# EAGLE design microcontroller (EAGLE 9.5.0)
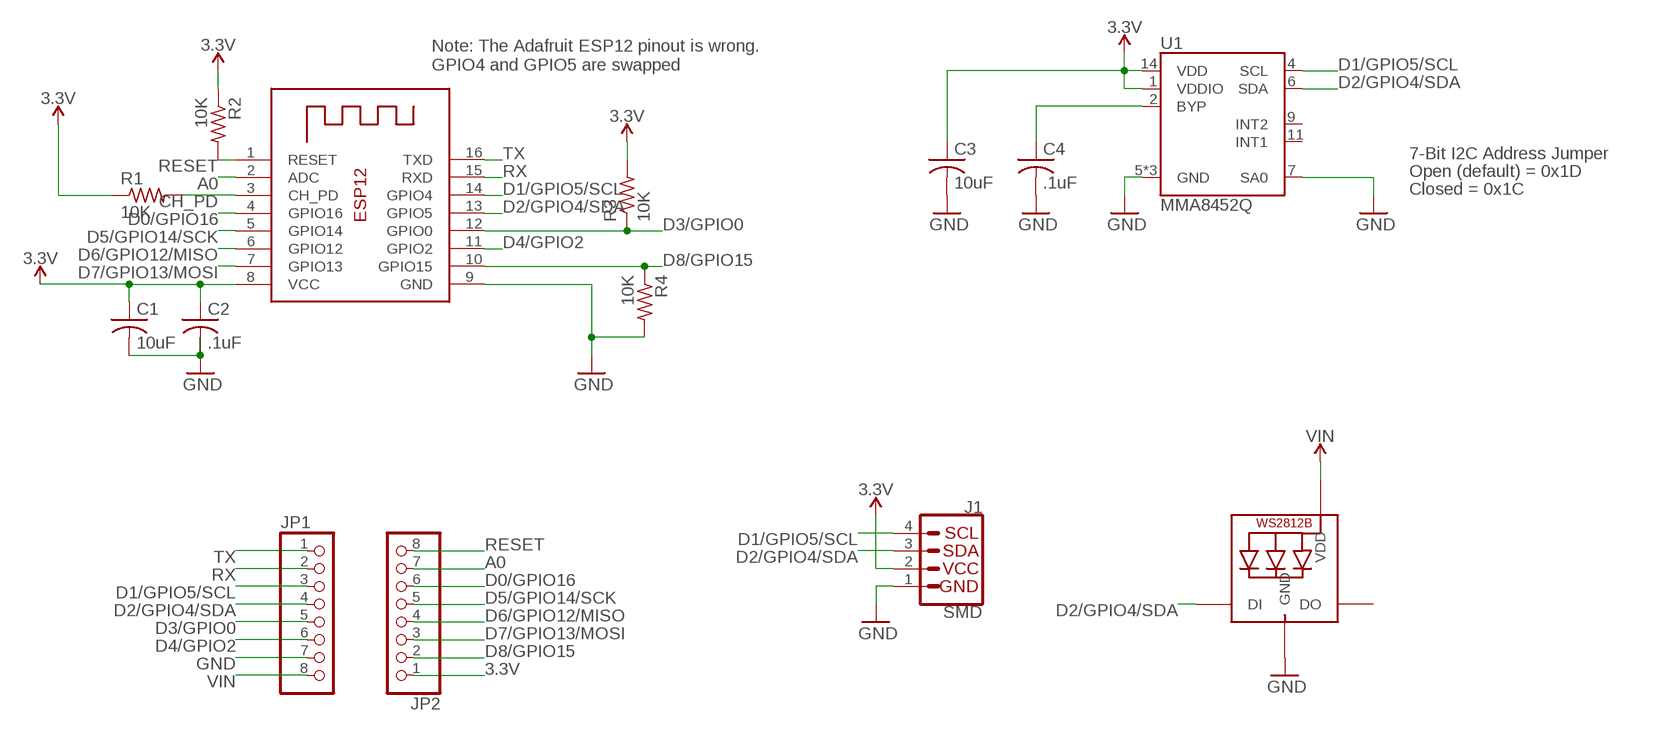
[diagram p0: schematic, sheet 1]

## Parts
C1  10uF  C-USC0805  [C0805]
C2  .1uF  C-USC0805  [C0805]
C3  10uF  C-USC0805  [C0805]
C4  .1uF  C-USC0805  [C0805]
J1  SMD  I2C_STANDARDJS-1MM  [1X04_1MM_RA]
JP1  PINHD-1X8CLEANBIG  [1X08-CLEANBIG]
JP2  PINHD-1X8CLEANBIG  [1X08-CLEANBIG]
LED1  WS2812B5050  [WS2812B]
R1  10K  R-US_R0805  [R0805]
R2  10K  R-US_R0805  [R0805]
R3  10K  R-US_R0805  [R0805]
R4  10K  R-US_R0805  [R0805]
U1  MMA8452Q  [QFN-16_0.5MM]
X1  ESP-12  [ESP-12]

## Nets
3.3V [power]: C1.1 C2.1 C3.1 J1.2(VCC) JP2.1 R1.1 R2.1 R3.2 U1.1(VDDIO) U1.14(VDD) X1.8(VCC)
A0: JP2.7 X1.2(ADC)
BYP: C4.1 U1.2(BYP)
CH_PD: R1.2 X1.3(CH_PD)
D0/GPIO16: JP2.6 X1.4(GPIO16)
D1/GPIO5/SCL: J1.4(SCL) JP1.3 U1.4(SCL) X1.14(GPIO4)
D2/GPIO4/SDA: J1.3(SDA) JP1.4 LED1.4-DIN(DI) U1.6(SDA) X1.13(GPIO5)
D3/GPIO0: JP1.5 R3.1 X1.12(GPIO0)
D4/GPIO2: JP1.6 X1.11(GPIO2)
D5/GPIO14/SCK: JP2.5 X1.5(GPIO14)
D6/GPIO12/MISO: JP2.4 X1.6(GPIO12)
D7/GPIO13/MOSI: JP2.3 X1.7(GPIO13)
D8/GPIO15: JP2.2 R4.1 X1.10(GPIO15)
GND: C1.2 C2.2 C3.2 C4.2 J1.1(GND) JP1.7 LED1.3-GND(GND) R4.2 U1.5(GND) U1.7(SA0) U1.10(GND) U1.12(GND) X1.9(GND)
RESET: JP2.8 R2.2 X1.1(RESET)
RX: JP1.2 X1.15(RXD)
TX: JP1.1 X1.16(TXD)
VIN [power]: JP1.8 LED1.1-VDD(VDD)
Unconnected: LED1.2-DOUT(DO) U1.9(INT2) U1.11(INT1)

## Notes on the sheet
- Note: The Adafruit ESP12 pinout is wrong.
  GPIO4 and GPIO5 are swapped
- 7-Bit I2C Address Jumper
- Open (default) = 0x1D
- Closed = 0x1C

## Library data of the parts
C1 = adafruit:C-US: CAPACITOR, American symbol; MPN: LMK212BJ106KG-T
C2 = adafruit:C-US: CAPACITOR, American symbol; MPN: C0805C104M3RACTU
C3 = adafruit:C-US: CAPACITOR, American symbol; MPN: LMK212BJ106KG-T; POPULATE: 1
C4 = adafruit:C-US: CAPACITOR, American symbol; MPN: C0805C104M3RACTU; POPULATE: 1
J1 = SparkX:I2C_STANDARD: SparkFun I2C Standard Pinout Header SparkFun has standardized on a pinout for all I2C based sensor breakouts. This pinout allows I2C boards to be plugged directly into the headers on Arduino Uno compatible boards, and to be daisy chained easily. Example SparkFun Products: SparkFun Atmospheric Sensor Breakout - BME280 <https://www.sparkfun.com/products/13676> SparkFun Altitude/Pressure Sensor Breakout - MPL3115A2 <https://www.sparkfun.com/products/11084> SparkFun TOF Range Finder Sensor - VL6180 <https://www.sparkfun.com/products/12785>; MPN: PRT-14417; POPULATE: 0
JP1 JP2 = adafruit:PINHD-1X8: PIN HEADER; BOTTOM: 1; MPN: 8Fx1L-254mm; THRU-HOLE: 1
LED1 = adafruit:WS2812B; MPN: 1655; POPULATE: 0
R1-R4 = adafruit:R-US_: RESISTOR, American symbol; MPN: CRCW080510K0FKEAC
U1 = SparkX:MMA8452Q: MMA8452Q 3-Axis, 12/8-bit Digital Accelerometer Supply Voltage: 1.6-3.6V Range: +/- 2g, 4g, 8g Interface: I2C, 12-bit and 8-bit ODR: 1.56 Hz - 800 Hz Package: QFN-16 http://cache.freescale.com/files/sensors/doc/data_sheet/MMA8452Q.pdf; MPN: MMA8452QR1; POPULATE: 1
X1 = adafruit:ESP-12; MPN: ESP12

## Net classes
1 power: width 0.406 mm

## Board
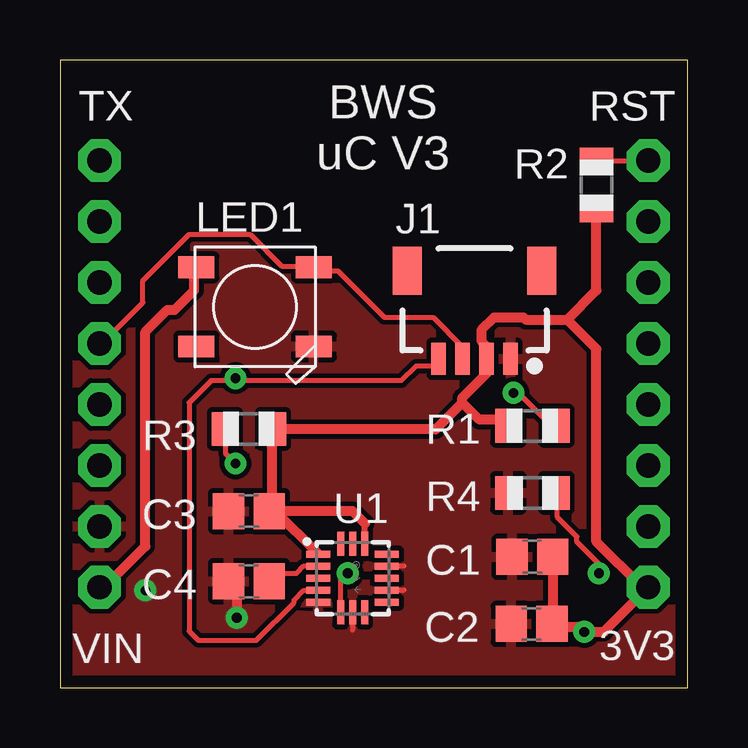
[diagram p1: board, top side]
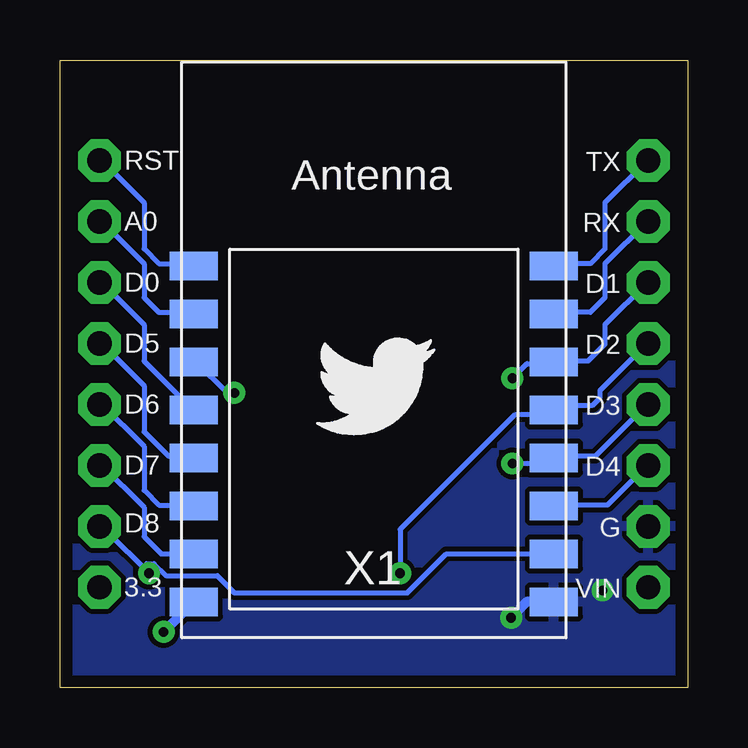
[diagram p2: board, bottom side, seen from below]

Size 26.16 x 26.16 mm. Coordinates in mm from the lower left corner, seen from the top.
Outline: 0,26.16 0,0 26.16,0 26.16,26.16 0,26.16
Copper layers (1*16): Top 0.035mm / dielectric 1.5mm / Bottom 0.035mm
Design rules "PCBCart-Standard *": minimum track width 8mil, minimum drill 0.4mm, track to track 8mil, track to pad 8mil, pad to pad 8mil, via to via 8mil, smd to smd 8mil, copper to edge 20mil, drill to drill 8mil, minimum pad ring 8mil, minimum via ring 10mil, stop-mask expansion 3mil, vias tented up to drill 20mil, thermal gap 8mil
bRestrict: area 45,46.8 to 45.2,47.3; area 46,47.6 to 46.5,47.8

### Footprints (pad centres in the part's own frame; a part is rotated, then mirrored left to right if it is on the bottom)
C0805 = smd 1.3 x 1.5: 1 -0.85,0; 2 0.85,0
1X04_1MM_RA = smd 0.6 x 1.35: 1 -1.5,0; 2 -0.5,0; 3 0.5,0; 4 1.5,0 | smd 1.2 x 2: NC1 2.8,-3.675; NC2 -2.8,-3.675
1X08-CLEANBIG = drill 1.016 pad 1.778 octagon: 1 -8.89,0; 2 -6.35,0; 3 -3.81,0; 4 -1.27,0; 5 1.27,0; 6 3.81,0; 7 6.35,0; 8 8.89,0
WS2812B = smd 1.5 x 0.9: 1-VDD 2.45,-1.65; 2-DOUT 2.45,1.65; 3-GND -2.45,1.65; 4-DIN -2.45,-1.65
R0805 = smd 1.1 x 1.4: 1 -1,0; 2 1,0
QFN-16_0.5MM = smd 1 x 0.3: 1 -1.425,1; 2 -1.425,0.5; 3 -1.425,0; 4 -1.425,-0.5; 5 -1.425,-1; 9 1.425,-1; 10 1.425,-0.5; 11 1.425,0; 12 1.425,0.5; 13 1.425,1 | smd 0.3 x 1: 6 -0.5,-1.425; 7 0,-1.425; 8 0.5,-1.425; 14 0.5,1.425; 15 0,1.425; 16 -0.5,1.425
ESP-12 = smd 2 x 1.2: 1 -7.5,4.5; 2 -7.5,2.5; 3 -7.5,0.5; 4 -7.5,-1.5; 5 -7.5,-3.5; 6 -7.5,-5.5; 7 -7.5,-7.5; 8 -7.5,-9.5; 9 7.5,-9.5; 10 7.5,-7.5; 11 7.5,-5.5; 12 7.5,-3.5; 13 7.5,-1.5; 14 7.5,0.5; 15 7.5,2.5; 16 7.5,4.5

### Placement (x,y rotation side)
C1  19.68,5.46 180 top
C2  19.65,2.67 180 top
C3  7.87,7.37 180 top
C4  7.87,4.45 180 top
J1  17.27,13.72 180 top
JP1  1.65,13.08 270 bottom
JP2  24.51,13.08 90 bottom
LED1  8.13,15.88 180 top
R1  19.68,10.92 0 top
R2  22.35,20.95 90 top
R3  7.87,10.79 0 top
R4  19.68,8.13 180 top
U1  12.19,4.57 0 top
U$1  [TWITTER5MM]  15.49,10.54 0 bottom
X1  13.08,13.08 0 bottom

### Tracks (layer width: path | path; a pad name or v marks a point on that pad's centre or on a via)
3.3V  (via drill 0.4)
  Top 0.254: U1.14 12.7,6.86 | U1.1 10.71,5.63
  Top 0.406: C3.1 8.74,7.42 8.84,7.52 8.84,10.77 R3.2 9.04,10.77 15.65,10.77 16.76,11.89 | 16.76,11.89 16.76,12.09 17.78,13.11 J1.2 17.78,13.82 17.78,14.22 17.58,14.43 17.58,14.94 18.09,15.44 19.3,15.44 19.41,15.34 21.13,15.34 | 16.76,11.89 17.48,11.18 18.39,11.18 18.59,10.97 R1.1 | R2.1 22.35,16.56 21.13,15.34 | 21.13,15.34 22.35,14.12 22.35,6.1 24.26,4.19 JP2.1 22.66,2.34 v21.84,2.34 21.64,2.54 20.62,2.54 C2.1 20.52,2.74 20.52,5.38 C1.1 | C3.1 8.97,7.37 10.71,5.63 | 12.7,6.86 12.19,7.37 C3.1
  Bottom 0.406: v21.84,2.34 20.62,3.56 X1.8
A0
  Bottom 0.203: X1.2 20.62,15.65 22.05,15.65 22.66,16.26 22.66,17.68 24.49,19.51 24.49,19.46 JP2.7
BYP
  Top 0.203: U1.2 10.67,5.08 10.16,5.08 9.86,4.78 9.04,4.78 8.74,4.47 C4.1
CH_PD  (via drill 0.4)
  Top 0.203: v18.9,12.29 19.1,12.09 19.3,12.09 20.42,10.97 20.62,10.97 R1.2
  Bottom 0.203: v18.9,12.29 19.2,12.29 20.52,13.61 X1.3
D0/GPIO16
  Bottom 0.203: X1.4 20.62,11.58 22.66,13.61 22.66,15.14 24.49,16.97 24.51,16.94 JP2.6
D1/GPIO5/SCL  (via drill 0.4)
  Top 0.203: 7.32,12.8 14.22,12.8 14.83,13.41 15.54,13.41 15.85,13.72 J1.4 | 7.32,12.8 6.3,12.8 5.38,11.89 5.38,2.36 5.77,1.98 8.18,1.98 9.75,3.56 9.75,3.66 10.16,4.06 10.67,4.06 U1.4 | 7.32,12.8 v7.32,12.9
  Bottom 0.203: v7.32,12.9 6.71,13.51 5.59,13.51 X1.14 5.49,13.61 4.17,13.61 3.45,14.33 3.45,15.14 1.7,16.89 JP1.3
D2/GPIO4/SDA  (via drill 0.4)
  Top 0.203: J1.3 16.76,14.22 15.54,15.44 13.51,15.44 11.58,17.37 10.77,17.37 10.67,17.48 LED1.4-DIN 10.57,17.58 9.25,17.58 7.92,18.9 5.38,18.9 3.45,16.97 3.45,16.05 1.73,14.33 JP1.4 | v11.99,4.78 11.68,4.47 U1.6
  Bottom 0.203: v11.99,4.78 11.99,6.6 7.21,11.38 5.69,11.38 5.59,11.48 X1.13 5.49,11.58 5.28,11.79 3.96,11.79 3.66,12.09 3.66,12.39 1.73,14.33 JP1.4
D3/GPIO0  (via drill 0.4)
  Top 0.203: v7.32,9.35 6.91,9.75 6.91,10.77 R3.1
  Bottom 0.203: v7.32,9.35 5.79,9.35 5.59,9.55 X1.12 5.49,9.65 3.86,9.65 1.7,11.81 JP1.5
D4/GPIO2
  Bottom 0.203: X1.11 5.49,7.62 3.35,7.62 1.7,9.27 JP1.6
D5/GPIO14/SCK
  Bottom 0.203: X1.5 20.62,9.65 21.64,9.65 22.66,10.67 22.66,12.6 24.49,14.43 24.51,14.4 JP2.5
D6/GPIO12/MISO
  Bottom 0.203: X1.6 20.62,7.62 22.05,7.62 22.66,8.23 22.66,10.06 24.49,11.89 24.49,11.84 JP2.4
D7/GPIO13/MOSI
  Bottom 0.203: X1.7 20.62,5.59 21.95,5.59 22.66,6.3 22.66,7.52 24.49,9.35 24.51,9.32 JP2.3
D8/GPIO15  (via drill 0.4)
  Top 0.203: v22.45,4.78 22.45,5.18 21.54,6.1 21.54,6.3 20.73,7.11 20.73,8.13 R4.1
  Bottom 0.203: X1.10 10.06,5.59 11.68,3.96 18.9,3.96 19.61,4.67 21.74,4.67 22.25,5.18 22.55,5.18 22.66,5.08 v22.45,4.78 24.23,6.55 24.33,6.55 JP2.2
GND  (via drill 0.4)
  Top 0.203: U1.7 12.19,2.54 12.19,2.42 | U1.10 13.72,4.06 14.22,4.06 14.34,4.07 | 14.34,5.07 U1.12 | 14.34,5.07
  Top 0.406: C4.2 7.37,4.1 v7.37,2.92
  Bottom 0.406: X1.9 6.71,3.58 v7.37,2.92
  other vias: 3.56,4.06
  pour Bottom (isolate 0.203): 26.16,26.16 0,26.16 0,0 26.16,0
  pour Top (isolate 0.203): 26.16,26.16 0,26.16 0,0 26.16,0
RESET
  Top 0.203: R2.2 24.49,21.95 JP2.8
  Bottom 0.203: X1.1 20.62,17.68 22.05,17.68 22.66,18.29 22.66,20.22 24.49,22.05 24.49,21.95 JP2.8
RX
  Bottom 0.203: X1.15 5.49,15.65 4.06,15.65 3.45,16.26 3.45,17.68 1.7,19.43 JP1.2
TX
  Bottom 0.203: X1.16 5.49,17.68 4.06,17.68 3.45,18.29 3.45,20.22 1.7,21.97 JP1.1
VIN
  Top 0.406: LED1.1-VDD 5.59,17.48 5.59,16.56 4.78,15.75 4.47,15.75 3.56,14.83 3.56,5.89 1.93,4.27 1.73,4.27 JP1.8

### Text on the board
tNames: BWS / uC V3 | RST | TX | 3V3 | VIN
bNames: TX | RST | RX | A0 | D1 | D0 | D2 | D5 | D3 | D6 | D4 | D7 | G | D8 | VIN | 3.3